# Altium schematic sheet Altium_Circuit_1_v03_CLOCK_4Plane_Page1.schdoc
size 309 x 223 mm; Symbol: Sheet-Symbol_A4; Device: Sheet-Symbol_A4; @Project Name: The20c_v03; @Page Count: 2; @Update Date: 2024-12-30; @Create Date: 2024-08-20; @Schematic Name: v03_CLOCK_4Plane; @Page No: 1; @Page Name: v03_CLOCK_4Plane_Page1; Company: OsoLabs.tech; Reviewed: OsoLabs.tech; Version: V3.0; Page Size: A4; Part Number: v03_CLOCK_4Plane; Drawn: OsoLabs.tech; @Board Name: v03_CLOCK_4Plane; @Create Time: 17:16:52; @Update Time: 00:07:48
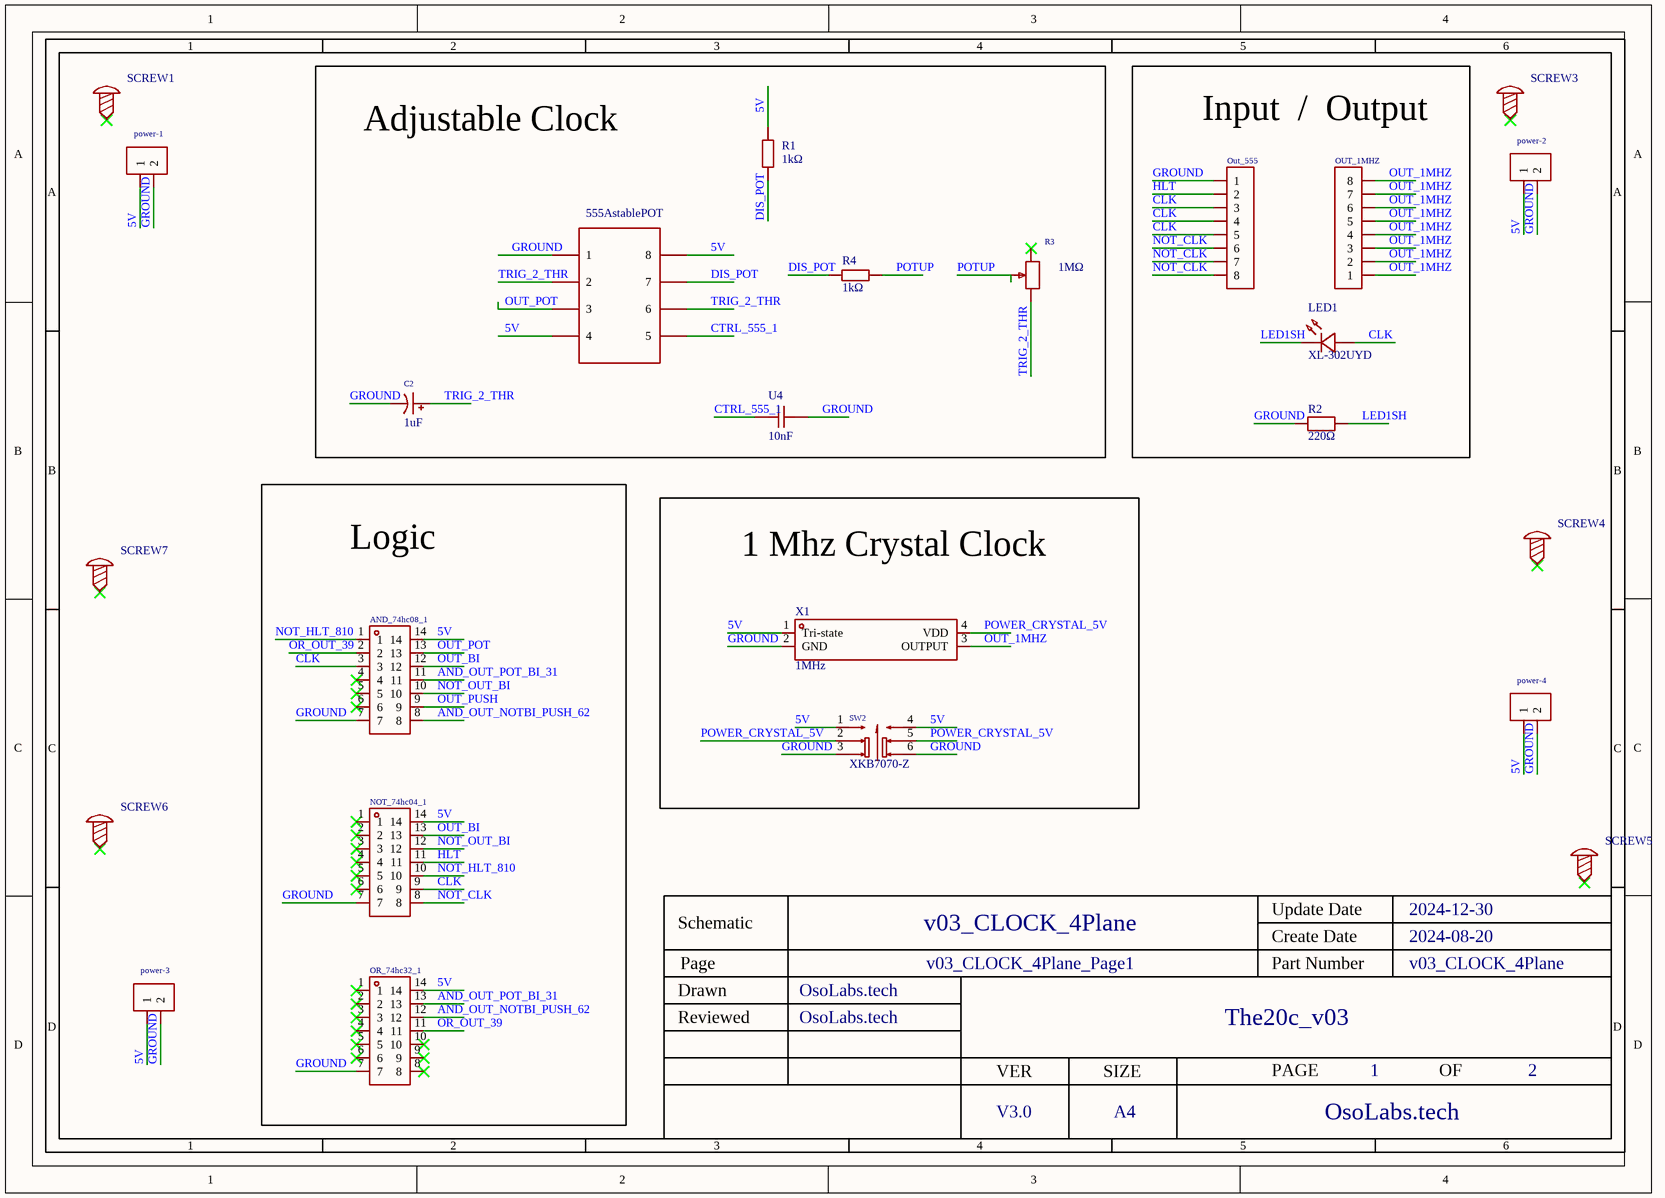
[diagram p0: Altium_Circuit_1_v03_CLOCK_4Plane_Page1.schdoc]

## Parts
555AstablePOT  DS1009-08AT1NX-0A2  [DIP-8_L10.2-W10.2-P2.54-LS7.6-BL]  (value not drawn)
AND_74hc08_1  IC-14P窄  [DIP-14_L17.8-W10.2-P2.54-BL]  (value not drawn)
C2  1uF  [CAP-TH_BD5.0-P2.00-D0.8-FD]  (value not drawn)
LED1  XL-302UYD  [LED-TH_BD3.8-P2.54-FD_YELLOW]  (value not drawn)
NOT_74hc04_1  IC-14P窄  [DIP-14_L17.8-W10.2-P2.54-BL]  (value not drawn)
OR_74hc32_1  IC-14P窄  [DIP-14_L17.8-W10.2-P2.54-BL]  (value not drawn)
OUT_1MHZ  2.54-1*8P母环保  [HDR-TH_8P-P2.54-V-F-1]  (value not drawn)
Out_555  2.54-1*8P母环保  [HDR-TH_8P-P2.54-V-F-1]  (value not drawn)
power-1  2.54-1*2P母  [HDR-TH_2P-P2.54-V-F]  (value not drawn)
power-2  2.54-1*2P母  [HDR-TH_2P-P2.54-V-F]  (value not drawn)
power-3  2.54-1*2P母  [HDR-TH_2P-P2.54-V-F]  (value not drawn)
power-4  2.54-1*2P母  [HDR-TH_2P-P2.54-V-F]  (value not drawn)
R1  1kΩ  [RES-TH_BD2.7-L6.2-P10.20-D0.4]  (value not drawn)
R2  220Ω  [RES-TH_BD2.7-L6.2-P10.20-D0.4]  (value not drawn)
R3  1MΩ  [RES-ADJ-TH_3296W]  (value not drawn)
R4  1kΩ  [RES-TH_BD2.7-L6.2-P10.20-D0.4]  (value not drawn)
SCREW1  Screw-Hole-M3  [Screw-Hole-M3]  (value not drawn)
SCREW3  Screw-Hole-M3  [Screw-Hole-M3]  (value not drawn)
SCREW4  Screw-Hole-M3  [Screw-Hole-M3]  (value not drawn)
SCREW5  Screw-Hole-M3  [Screw-Hole-M3]  (value not drawn)
SCREW6  Screw-Hole-M3  [Screw-Hole-M3]  (value not drawn)
SCREW7  Screw-Hole-M3  [Screw-Hole-M3]  (value not drawn)
SW2  XKB7070-Z  [SW-TH_6P-L7.0-W7.0-P2.00]  (value not drawn)
U4  10nF  [CAP-TH_L4.8-W3.2-P5.08-D1.2]  (value not drawn)
X1  1MHz  [OSC-SMD_4P-L7.0-W5.0-BL_7W16070003]  (value not drawn)

## Blocks framed on the sheet
Adjustable Clock: 555AstablePOT C2 R1 R3 R4 U4
Input  /  Output: LED1 OUT_1MHZ Out_555 R2
Logic: AND_74hc08_1 NOT_74hc04_1 OR_74hc32_1
1 Mhz Crystal Clock: SW2 X1

## Nets
5V: 555AstablePOT.4 555AstablePOT.8 AND_74hc08_1.14 NOT_74hc04_1.14 OR_74hc32_1.14 power-1.1 power-2.1 power-3.1 power-4.1 R1.2 SW2.1 SW2.4 X1.1(Tri-state)
AND_OUT_NOTBI_PUSH_62: AND_74hc08_1.8 OR_74hc32_1.12
AND_OUT_POT_BI_31: AND_74hc08_1.11 OR_74hc32_1.13
CLK: AND_74hc08_1.3 LED1.1(A) NOT_74hc04_1.9 Out_555.3 Out_555.4 Out_555.5
CTRL_555_1: 555AstablePOT.5 U4.1
DIS_POT: 555AstablePOT.7 R1.1 R4.1
GROUND: 555AstablePOT.1 AND_74hc08_1.7 C2.2 NOT_74hc04_1.7 OR_74hc32_1.7 Out_555.1 power-1.2 power-2.2 power-3.2 power-4.2 R2.1 SW2.3 SW2.6 U4.2 X1.2(GND)
HLT: NOT_74hc04_1.11 Out_555.2
LED1SH: LED1.2(K) R2.2
NOT_CLK: NOT_74hc04_1.8 Out_555.6 Out_555.7 Out_555.8
NOT_HLT_810: AND_74hc08_1.1 NOT_74hc04_1.10
NOT_OUT_BI: AND_74hc08_1.10 NOT_74hc04_1.12
OR_OUT_39: AND_74hc08_1.2 OR_74hc32_1.11
OUT_1MHZ: OUT_1MHZ.1 OUT_1MHZ.2 OUT_1MHZ.3 OUT_1MHZ.4 OUT_1MHZ.5 OUT_1MHZ.6 OUT_1MHZ.7 OUT_1MHZ.8 X1.3(OUTPUT)
OUT_BI: AND_74hc08_1.12 NOT_74hc04_1.13
OUT_POT: 555AstablePOT.3 AND_74hc08_1.13
OUT_PUSH: AND_74hc08_1.9
POTUP: R3.2 R4.2
POWER_CRYSTAL_5V: SW2.2 SW2.5 X1.4(VDD)
TRIG_2_THR: 555AstablePOT.2 555AstablePOT.6 C2.1 R3.3

Not connected (* = marked no-connect by the designer): AND_74hc08_1 4* 5* 6*; NOT_74hc04_1 1* 2* 3* 4* 5* 6*; OR_74hc32_1 1* 2* 3* 4* 5* 6* 8* 9* 10*; R3 1*; SCREW1 1*; SCREW3 1*; SCREW4 1*; SCREW5 1*; SCREW6 1*; SCREW7 1*

## Notes on the sheet
- 1
- 2
- 3
- 4
- 5
- 6
- A
- B
- C
- Schematic
- v03_CLOCK_4Plane
- Create Date
- Update Date
- 2024-12-30
- 2024-08-20
- Reviewed
- Drawn
- Page
- OsoLabs.tech
- v03_CLOCK_4Plane_Page1
- Part Number
- The20c_v03
- D
- VER
- SIZE
- PAGE
- OF
- V3.0
- A4

## Library data of the parts
555AstablePOT = DS1009-08AT1NX-0A2: IC Type:DIP Pitch:2.54mm Row Spacing:7.62mm Number of Positions:8P Contact Plating:Tin; Manufacturer: CONNFLY; Add into BOM: yes; IC Type: DIP; Pitch: 2.54mm; Row Spacing: 7.62mm; Number of Positions: 8P; Symbol: DS1009-08AT1NX-0A2; Device: DS1009-08AT1NX-0A2; LCSC Part Name: 间距2.54mm P数:8P; Supplier Part: C72124; Manufacturer Part: DS1009-08AT1NX-0A2; Supplier Footprint: DIP-8; JLCPCB Part Class: Extended Part; Datasheet: https://atta.szlcsc.com/upload/public/pdf/source/20160429/1461922462758.pdf; Supplier: LCSC; Convert to PCB: yes; Contact Plating: Tin
AND_74hc08_1 NOT_74hc04_1 OR_74hc32_1 = IC-14P窄: IC Type:DIP Pitch:2.54mm Row Spacing:7.62mm Number of Positions:14P Contact Plating:-; Manufacturer: BOOMELE(博穆精密); Symbol: IC seat 14P; Add into BOM: yes; IC Type: DIP; Pitch: 2.54mm; Row Spacing: 7.62mm; Number of Positions: 14P; Device: IC-14P窄; Supplier: LCSC; Supplier Part: C2325; Manufacturer Part: IC-14P窄; JLCPCB Part Class: Extended Part; LCSC Part Name: 间距2.54mm P数:14P; Supplier Footprint: DIP-14; Datasheet: https://atta.szlcsc.com/upload/public/pdf/source/20151118/1457707579760.pdf; Convert to PCB: yes; Contact Plating: -
C2 = KF010M050C110A: Capacitance: Tolerance:±20% Tolerance:±20% Rated Voltage: Lead Spacing: φD: L: Lifetime @ Temp:2000hrs@105℃; Manufacturer: CapXon(丰宾); Add into BOM: yes; Tolerance: ±20%; Symbol: KF010M050C110A; Device: KF010M050C110A; Supplier: LCSC; Manufacturer Part: KF010M050C110A; Value: 1uF; Supplier Part: C62934; JLCPCB Part Class: Extended Part; LCSC Part Name: 1uF ±20% 50V; Supplier Footprint: 插件,D5xL11mm; Datasheet: https://atta.szlcsc.com/upload/public/pdf/source/20160702/1467448308274.pdf; Convert to PCB: yes; Lifetime @ Temp: 2000hrs@105℃
LED1 = XL-302UYD: Lamp Holder Type:3mm圆形灯头 Emitted Color:Yellow Power Dissipation:80mW Forward Current:30mA Dominant Wavelength:585nm~590nm Dominant Wavelength:585nm~590nm Peak Wavelength:595nm Lens Color:黄色透镜 Color Temperature:- Color Temperature:- Viewing Angle:50° Mount; Manufacturer: XINGLIGHT(成兴光); Add into BOM: yes; Emitted Color: Yellow; Power Dissipation: 80mW; Forward Current: 30mA; Peak Wavelength: 595nm; Lens Color: 黄色透镜; Viewing Angle: 50°; Symbol: XL-302UYD; Device: XL-302UYD; LCSC Part Name: XL-302UYD; Supplier Part: C2895472; Manufacturer Part: XL-302UYD; Supplier Footprint: 插件,D=3mm; JLCPCB Part Class: Extended Part; Datasheet: https://atta.szlcsc.com/upload/public/pdf/source/20240112/80AE8C6861133F27C2471F21BB0705B6.pdf; Supplier: LCSC; Convert to PCB: yes; Lamp Holder Type: 3mm圆形灯头; Dominant Wavelength: 585nm~590nm; Color Temperature: -; Mounting Sytle: -; Operating Temperature: -25℃~+85℃
OUT_1MHZ Out_555 = 2.54-1*8P母环保: Holes Structure:1x8P Pitch:2.54mm Row Spacing:- Mounting Type:Straight Number of Rows:Plugin Number of Holes:8P Insulation Height:- Contact Material:- Contact Plating:-; Manufacturer: BOOMELE(博穆精密); Symbol: Header-Female-2.54_1x8; Add into BOM: yes; Holes Structure: 1x8P; Pitch: 2.54mm; Number of Holes: 8P; Device: 2.54-1*8P母环保; Supplier: LCSC; Manufacturer Part: 2.54-1*8P母环保; Supplier Part: C27438; JLCPCB Part Class: Extended Part; LCSC Part Name: 间距:2.54mm 1x8P 直插; Supplier Footprint: 插件,P=2.54mm; Datasheet: https://atta.szlcsc.com/upload/public/pdf/source/20231221/1CA800C6799ED97958773716FAA1BFFE.pdf; Convert to PCB: yes; Row Spacing: -; Mounting Type: Straight; Number of Rows: Plugin; Insulation Height: -; Contact Material: -; Contact Plating: -
power-1-power-4 = 2.54-1*2P母: Holes Structure:1x2P Pitch:2.54mm Row Spacing:- Mounting Type:Straight Number of Rows:Plugin Number of Holes:2P Insulation Height:- Contact Material:- Contact Plating:-; Manufacturer: BOOMELE(博穆精密); Symbol: Header-Female-2.54_1x2; Add into BOM: yes; Holes Structure: 1x2P; Pitch: 2.54mm; Number of Holes: 2P; Device: 2.54-1*2P母; Supplier: LCSC; Manufacturer Part: 2.54-1*2P母; Supplier Part: C49661; JLCPCB Part Class: Extended Part; LCSC Part Name: 间距:2.54mm 1x2P 直插; Supplier Footprint: 插件,P=2.54mm; Datasheet: https://atta.szlcsc.com/upload/public/pdf/source/20210301/C2718488_F4427B881E42CAA8DDB0B1C12B3A522C.pdf; Convert to PCB: yes; Row Spacing: -; Mounting Type: Straight; Number of Rows: Plugin; Insulation Height: -; Contact Material: -; Contact Plating: -
R1 R4 = CR1/4W-1K±5%-ST26: Type:Carbon Resister Resistance: Tolerance:±5% Tolerance:±5% Overload Voltage (Max):250V Power(Watts):250mW Temperature Coefficient:±350ppm/℃ Temperature Coefficient:±350ppm/℃ Operating Temperature Range:-55℃~+155℃ Operating Temperature Range:-55℃~+155℃; Manufacturer: VO(翔胜); Add into BOM: yes; Tolerance: ±5%; Overload Voltage (Max): 250V; Power(Watts): 250mW; Symbol: CR1/4W-1K±5%-ST26; Device: CR1/4W-1K±5%-ST26; LCSC Part Name: 碳膜电阻 1kΩ ±5% 250mW; Supplier Part: C2894606; Manufacturer Part: CR1/4W-1K±5%-ST26; Supplier Footprint: 插件,2.7x6.2mm; JLCPCB Part Class: Extended Part; Datasheet: https://atta.szlcsc.com/upload/public/pdf/source/20210803/C2857407_45FF53FE186CAB545115AD37303966CD.pdf; Supplier: LCSC; Convert to PCB: yes; Type: Carbon Resister; Value: 1kΩ; Temperature Coefficient: ±350ppm/℃; Operating Temperature Range: -55℃~+155℃
R2 = CR1/4W-220Ω±5%-ST26: Type:Carbon Resister Resistance: Tolerance:±5% Tolerance:±5% Overload Voltage (Max):250V Power(Watts):250mW Temperature Coefficient:±350ppm/℃ Temperature Coefficient:±350ppm/℃ Operating Temperature Range:-55℃~+155℃ Operating Temperature Range:-55℃~+155℃; Manufacturer: VO(翔胜); Add into BOM: yes; Tolerance: ±5%; Overload Voltage (Max): 250V; Power(Watts): 250mW; Symbol: CR1/4W-220Ω±5%-ST26; Device: CR1/4W-220Ω±5%-ST26; LCSC Part Name: 碳膜电阻 220Ω ±5% 250mW; Supplier Part: C2894616; Manufacturer Part: CR1/4W-220Ω±5%-ST26; Supplier Footprint: 插件,D2.7xL6.2mm; JLCPCB Part Class: Extended Part; Datasheet: https://atta.szlcsc.com/upload/public/pdf/source/20210803/C2857407_45FF53FE186CAB545115AD37303966CD.pdf; Supplier: LCSC; Convert to PCB: yes; Type: Carbon Resister; Value: 220Ω; Temperature Coefficient: ±350ppm/℃; Operating Temperature Range: -55℃~+155℃
R3 = 3296W-1-105-8mm: Resistance: Tolerance:±10% Tolerance:±10%; Manufacturer: BOCHEN(博晨); Symbol: 3296W-1-105_C330438; Resistance: 1M; Add into BOM: yes; Tolerance: ±10%; Device: 3296W-1-105-8mm; Supplier: LCSC; Supplier Part: C330438; Manufacturer Part: 3296W-1-105-8mm; Value: 1MΩ; JLCPCB Part Class: Extended Part; LCSC Part Name: 1MΩ ±10%; Supplier Footprint: 插件; Datasheet: https://atta.szlcsc.com/upload/public/pdf/source/20181127/C330438_D4133D377B8EE5AAFCEADB9B9868ED36.pdf; Convert to PCB: yes
SCREW1 SCREW3-SCREW7 = Screw-Hole-M3: Convert to PCB: yes; Symbol: Screw-Hole; Device: Screw-Hole-M3; Add into BOM: yes; Supplier Footprint: 插件
SW2 = XKB7070-Z: Self Lock / No Lock:LATCHING Actuator Style:Rectangle button IP Rating:- Mounting Style:Straight Contact Current:100mA Voltage Rating (AC):250V Voltage Rating (DC):30V Insulation Resistance:100MΩ Actuator/Cap Color:Blue With Lamp:不带 Pin Style:PCPin Operat; Manufacturer: XKB Connectivity(中国星坤); Add into BOM: yes; Contact Current: 100mA; Voltage Rating (AC): 250V; Voltage Rating (DC): 30V; Insulation Resistance: 100MΩ; Actuator/Cap Color: Blue; With Lamp: 不带; Pin Style: PCPin; Operating Force: 160gf; Mechanical Life: 10万次; Symbol: XKB7070-Z; Device: XKB7070-Z; Supplier: LCSC; Supplier Part: C318863; Manufacturer Part: XKB7070-Z; JLCPCB Part Class: Extended Part; LCSC Part Name: 按键开关   7*7插件自锁 蓝白黑; Supplier Footprint: 插件; Datasheet: https://atta.szlcsc.com/upload/public/pdf/source/20211015/75A682A27A424BDE8D93C2CFA14C38FE.pdf; Convert to PCB: yes; Self Lock / No Lock: LATCHING; Actuator Style: Rectangle button; IP Rating: -; Mounting Style: Straight; Operating Temperature: -15℃~+55℃
U4 = CC1H103ZC1ED3F4D1100: Capacitance:10nF Tolerance:-20%~+80% Tolerance:-20%~+80% Voltage Rated: Lead Spacing: Temperature Coefficient: φD: Body Thickness:2.6mm; Manufacturer: Dersonic(德尔创); Add into BOM: yes; Body Thickness: 2.6mm; Symbol: CC1H103ZC1ED3F4D1100; Device: CC1H103ZC1ED3F4D1100; LCSC Part Name: 10nF -20%~+80% 50V; Supplier Part: C2761727; Manufacturer Part: CC1H103ZC1ED3F4D1100; Supplier Footprint: 插件,P=5.08mm; JLCPCB Part Class: Extended Part; Datasheet: https://atta.szlcsc.com/upload/public/pdf/source/20211026/557BD244E4A8D86E9C6A3DB53C19BB73.pdf; Supplier: LCSC; Convert to PCB: yes; Value: 10nF; Tolerance: -20%~+80%
X1 = S7D1.000000A20F30T: Frequency:1MHz Normal temperature Frequency Tolerance:±20ppm Normal temperature Frequency Tolerance:±20ppm Output Type:CMOS Supply Voltage:5V Supply Voltage:5V Supply Current (Max):10mA Frequency Stability(Full temperature range):±30ppm Frequency Stabilit; Manufacturer: SCTF(星通时频); Add into BOM: yes; Normal temperature Frequency Tolerance: ±20ppm; Output Type: CMOS; Supply Voltage: 5V; Supply Current (Max): 10mA; Frequency Stability(Full temperature range): ±30ppm; Symbol: S7D1.000000A20F30T; Device: S7D1.000000A20F30T; LCSC Part Name: 1MHz ±20ppm 5V CMOS; Supplier Part: C386887; Manufacturer Part: S7D1.000000A20F30T; Supplier Footprint: SMD7050-4P; JLCPCB Part Class: Extended Part; Datasheet: https://atta.szlcsc.com/upload/public/pdf/source/20220428/A9C559F2882A09E13E49EAE9C5A8F46A.pdf; Supplier: LCSC; Convert to PCB: yes; Value: 1MHz; Operating Temperature: -40℃~+85℃